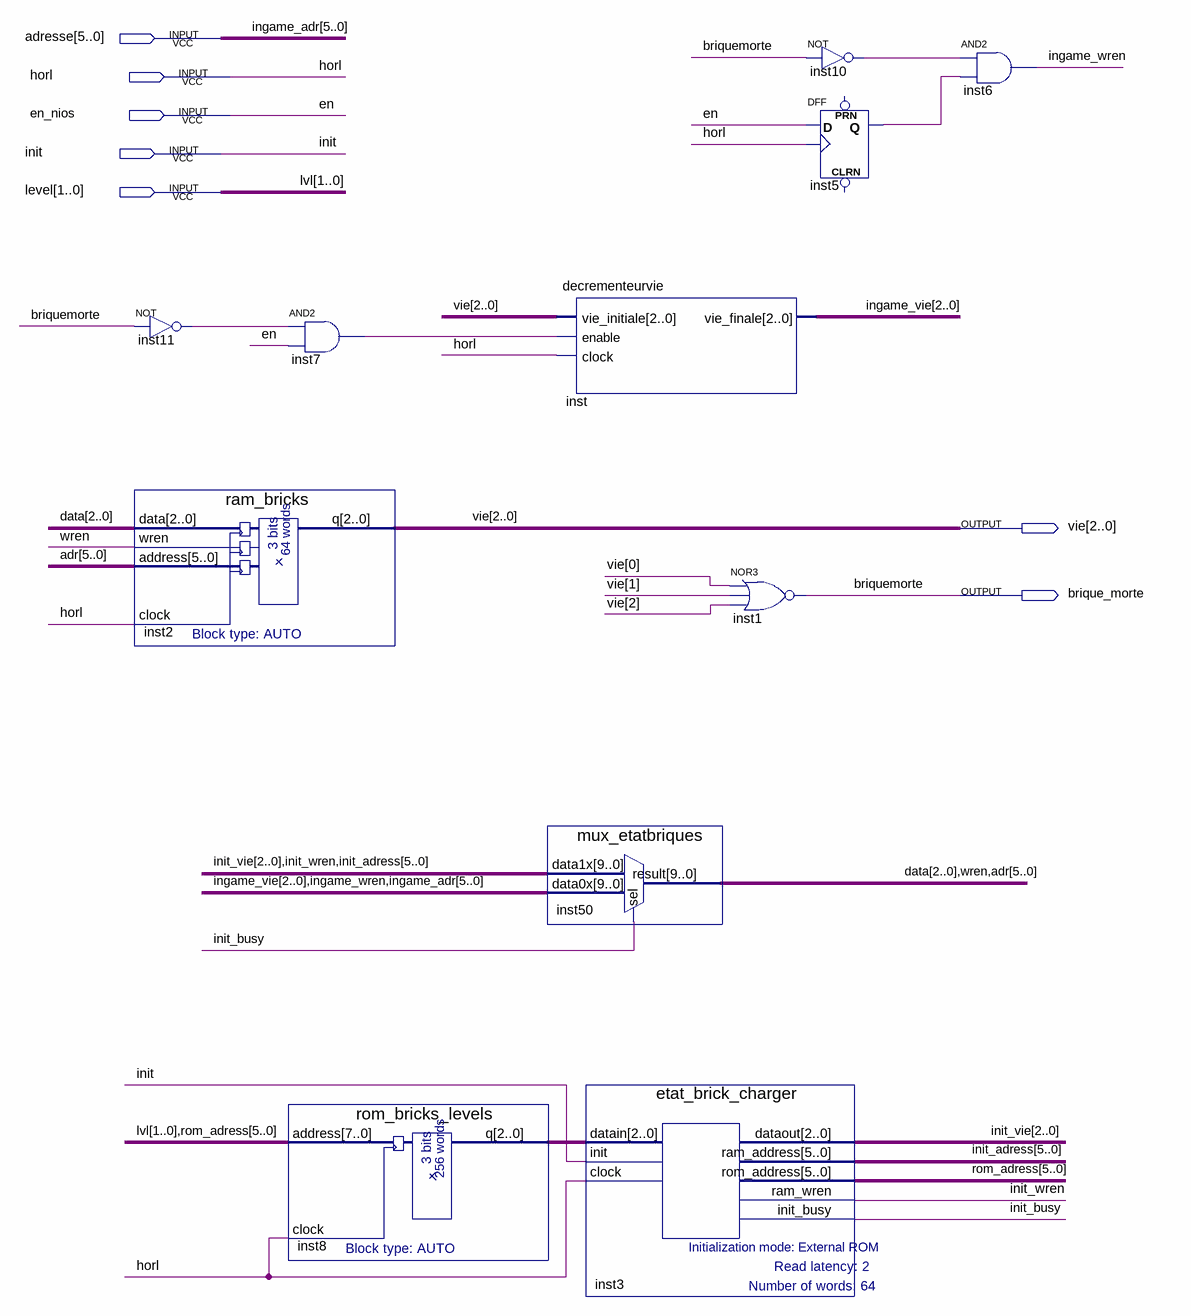
[diagram p0: schematic sheet]
// Quartus schematic etat_briques.bdf as structural Verilog: 11 symbols, 7 pins
module etat_briques (
  input  [5:0] adresse,
  input  horl,
  input  en_nios,
  input  init,
  input  [1:0] level,
  output [2:0] vie,
  output brique_morte
);

  wire ingame_wren, init_busy, init_wren, inst5_q, inst7_out, inst10_out, inst11_out, wren;
  wire [2:0] data, ingame_vie, init_vie, inst8_q;
  wire [5:0] adr, init_adress, rom_adress;

  not inst11 (inst11_out, brique_morte);
  ram_bricks inst2 (.data(data), .wren(wren), .address(adr), .clock(horl), .q(vie));
  and inst7 (inst7_out, inst11_out, en_nios);
  rom_bricks_levels inst8 (.address({level, rom_adress}), .clock(horl), .q(inst8_q));
  mux_etatbriques inst50 (
    .data1x({init_vie, init_wren, init_adress}), .data0x({ingame_vie, ingame_wren, adresse}),
    .sel(init_busy), .result({data, wren, adr}));
  decrementeurvie inst (.vie_initiale(vie), .enable(inst7_out), .clock(horl), .vie_finale(ingame_vie));
  etat_brick_charger inst3 (
    .datain(inst8_q), .init(init), .clock(horl), .dataout(init_vie), .ram_address(init_adress),
    .rom_address(rom_adress), .ram_wren(init_wren), .init_busy(init_busy));
  nor inst1 (brique_morte, vie[0], vie[1], vie[2]);
  not inst10 (inst10_out, brique_morte);
  DFF inst5 (.CLK(horl), .D(en_nios), .Q(inst5_q));  // open: CLRN, PRN
  and inst6 (ingame_wren, inst10_out, inst5_q);

  // Other names for the same wires on the sheet: briquemorte = brique_morte; en = en_nios; ingame_adr[5:0] = adresse;
  //   lvl[1:0] = level
endmodule
